# EAGLE design MainBoard 11-12 (EAGLE 5.11)
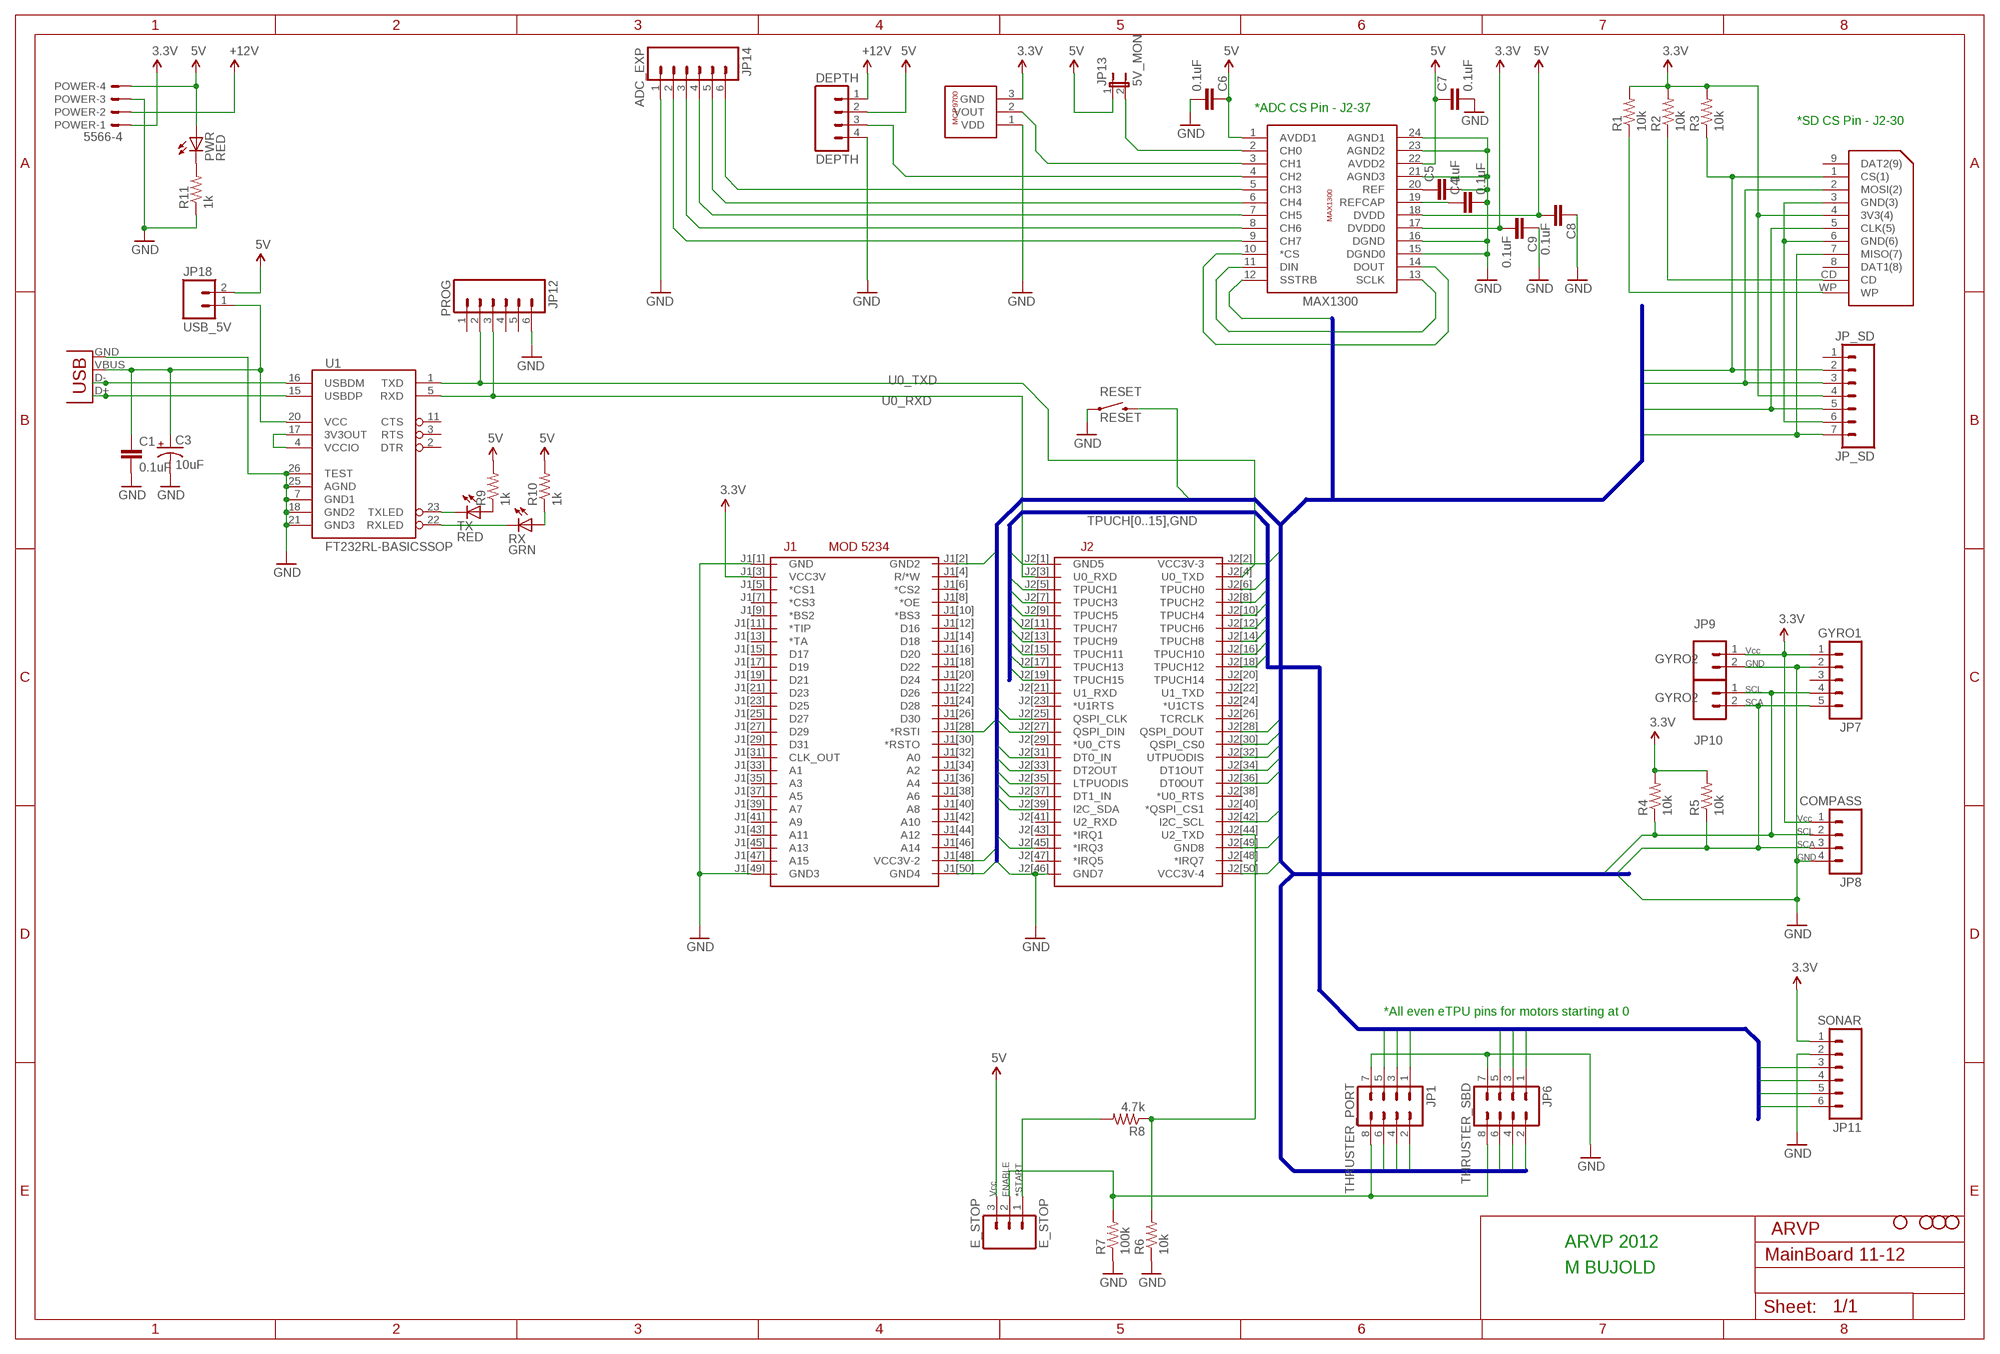
[diagram p0: schematic, sheet 1]

## Parts
C1  0.1uF  CAP1206  [1206]
C3  10uF  CAP_POL1206  [EIA3216]
C4  0.1uF  CAP1206  [1206]
C5  1uF  CAP1206  [1206]
C6  0.1uF  CAP1206  [1206]
C7  0.1uF  CAP1206  [1206]
C8  0.1uF  CAP1206  [1206]
C9  0.1uF  CAP1206  [1206]
DEPTH  DEPTH  M04POLAR  [MOLEX-1X4]
E_STOP  E_STOP  M03POLAR  [MOLEX-1X3]
JP1  THRUSTER_PORT  M04X2  [2X4]
JP2  STAND-OFF  [STAND-OFF]
JP3  STAND-OFF  [STAND-OFF]
JP4  STAND-OFF  [STAND-OFF]
JP5  STAND-OFF  [STAND-OFF]
JP6  THRUSTER_SBD  M04X2  [2X4]
JP7  GYRO1  M05LOCK  [1X05_LOCK]
JP8  COMPASS  M04POLAR_LOCK  [MOLEX-1X4_LOCK]
JP9  GYRO2  M02PTH  [1X02]
JP10  GYRO2  M02PTH  [1X02]
JP11  SONAR  M06LOCK  [1X06_LOCK]
JP12  PROG  M06LOCK  [1X06_LOCK]
JP13  5V_MON  JUMPER-2PTH_LOCK  [1X02_LOCK]
JP14  ADC_EXP  M06LOCK  [1X06_LOCK]
JP18  USB_5V  M02LOCK  [1X02_LOCK]
JP_SD  JP_SD  M07LOCK  [1X07_LOCK]
POWER  5566-4  [5566-4]
PWR  RED  LED3MM  [LED3MM]
R1  10k  RESISTOR1206  [1206]
R2  10k  RESISTOR1206  [1206]
R3  10k  RESISTOR1206  [1206]
R4  10k  RESISTOR1206  [1206]
R5  10k  RESISTOR1206  [1206]
R6  10k  RESISTOR1206  [1206]
R7  100k  RESISTOR1206  [1206]
R8  4.7k  RESISTOR1206  [1206]
R9  1k  RESISTOR1206  [1206]
R10  1k  RESISTOR1206  [1206]
R11  1k  RESISTOR1206  [1206]
RESET  SWITCH-MOMENTARY-2PTH  [TACTILE-PTH]
RX  GRN  LED3MM  [LED3MM]
TX  RED  LED3MM  [LED3MM]
U1  FT232RL-BASICSSOP  [SSOP28DB]
U$1  MOD5234  [MOD5234]
U$2  SD_CARD  [SD_CARD]
U$5  MAX1300  [MAX1300]
U$6  MCP9700  [TO-92]
U$7  ARVP_LOGO  [ARVP]
X2  USB-SMD-NS  [USB-MINIB-NOSTOP]

## Nets
3.3V: C9.2 JP7.1 JP8.1 JP9.1 JP11.1 JP_SD.4 POWER.1 R1.2 R2.2 R3.2 R4.2 R5.2 U$1.J1[3](VCC3V) U$2.4(3V3(4)) U$5.17(DVDD0) U$6.3(GND)
5V: C6.1 C7.1 C8.2 DEPTH.2 E_STOP.3 JP13.1 JP18.2 POWER.4 PWR.A R9.2 R10.2 U$5.1(AVDD1) U$5.18(DVDD) U$5.22(AVDD2)
12V: DEPTH.1 POWER.2 ; supply symbol labelled +12V
*IRQ3: U$1.J2[45](*IRQ3) U$5.12(SSTRB)
*RSTI: RESET.3 U$1.J1[28](*RSTI)
CS_ADC: U$1.J2[37](DT1_IN) U$5.10(*CS)
CS_SD: JP_SD.2 R3.1 U$1.J2[30](QSPI_CS0) U$2.1(CS(1))
DIR0: JP6.2 U$1.J2[31](DT0_IN)
DIR1: JP1.6 U$1.J2[32](UTPUODIS)
DIR2: JP6.4 U$1.J2[33](DT2OUT)
DIR3: JP1.4 U$1.J2[34](DT1OUT)
DIR4: JP6.6 U$1.J2[35](LTPUODIS)
DIR5: JP1.2 U$1.J2[36](DT0OUT)
GND: C1.2 C3.C(-) C4.2 C5.2 C6.2 C7.2 C8.1 C9.1 DEPTH.4 JP1.7 JP6.7 JP7.2 JP8.4 JP9.2 JP11.2 JP12.6 JP14.1 POWER.3 R6.1 R7.1 R11.1 RESET.1 U1.7(GND1) U1.18(GND2) U1.21(GND3) U1.25(AGND) U1.26(TEST) U$1.J1[1](GND) U$1.J1[2](GND2) U$1.J1[49](GND3) U$1.J1[50](GND4) U$1.J2[1](GND5) U$1.J2[46](GND7) U$1.J2[49](GND8) U$5.15(DGND0) U$5.16(DGND) U$5.21(AGND3) U$5.23(AGND2) U$5.24(AGND1) U$6.1(VDD) X2.GND
I2C_SCL: JP7.4 JP8.2 JP10.1 R4.1 U$1.J2[42](I2C_SCL)
I2C_SDA: JP7.5 JP8.3 JP10.2 R5.1 U$1.J2[39](I2C_SDA)
N$1: C1.1 C3.A(+) JP18.1 U1.20(VCC) X2.VBUS
N$2: R6.2 R8.1 U$1.J2[44](U2_TXD)
N$3: C4.1 U$5.19(REFCAP)
N$4: PWR.K(C) R11.2
N$5: U$5.3(CH1) U$6.2(VOUT)
N$6: U1.15(USBDP) X2.D+
N$7: JP14.3 U$5.8(CH6)
N$8: TX.K(C) U1.23(TXLED)
N$9: RX.K(C) U1.22(RXLED)
N$10: JP13.2 U$5.2(CH0)
N$11: E_STOP.2 JP1.8 JP6.8 R7.2
N$12: R9.1 TX.A
N$13: JP14.4 U$5.7(CH5)
N$14: JP14.5 U$5.6(CH4)
N$15: DEPTH.3 U$5.4(CH2)
N$16: JP14.6 U$5.5(CH3)
N$17: C5.1 U$5.20(REF)
N$18: R10.1 RX.A
N$19: U1.4(VCCIO) U1.17(3V3OUT)
N$20: JP14.2 U$5.9(CH7)
N$21: JP_SD.6 U$2.3(GND(3)) U$2.6(GND(6))
N$22: R2.1 U$2.CD
N$24: R1.1 U$2.WP
N$43: E_STOP.1 R8.2
PROG: U1.16(USBDM) X2.D-
QSPI_CLK: JP_SD.5 U$1.J2[25](QSPI_CLK) U$2.5(CLK(5)) U$5.13(SCLK)
QSPI_DIN: U$1.J2[27](QSPI_DIN) U$5.14(DOUT)
QSPI_DOUT: JP_SD.3 JP_SD.7 U$1.J2[28](QSPI_DOUT) U$2.2(MOSI(2)) U$2.7(MISO(7)) U$5.11(DIN)
TPUCH0: JP6.1 U$1.J2[6](TPUCH0)
TPUCH1: JP11.3 U$1.J2[5](TPUCH1)
TPUCH2: JP6.3 U$1.J2[8](TPUCH2)
TPUCH3: JP11.4 U$1.J2[7](TPUCH3)
TPUCH4: JP6.5 U$1.J2[10](TPUCH4)
TPUCH5: JP11.5 U$1.J2[9](TPUCH5)
TPUCH6: JP1.1 U$1.J2[12](TPUCH6)
TPUCH7: JP11.6 U$1.J2[11](TPUCH7)
TPUCH8: JP1.3 U$1.J2[14](TPUCH8)
TPUCH9: U$1.J2[13](TPUCH9)
TPUCH10: JP1.5 U$1.J2[16](TPUCH10)
TPUCH11: U$1.J2[15](TPUCH11)
TPUCH12: U$1.J2[18](TPUCH12)
TPUCH13: U$1.J2[17](TPUCH13)
TPUCH15: U$1.J2[19](TPUCH15)
U0_RXD: JP12.3 U1.5(RXD) U$1.J2[3](U0_RXD)
U0_TXD: JP12.2 U1.1(TXD) U$1.J2[4](U0_TXD)
VCC3V: U$1.J1[48](VCC3V-2) U$1.J2[2](VCC3V-3) U$1.J2[50](VCC3V-4)
Unconnected: JP7.3 JP12.1 JP12.4 JP12.5 JP_SD.1 U1.2(DTR) U1.3(RTS) U1.11(CTS) U$1.J1[4](R/*W) U$1.J1[5](*CS1) U$1.J1[6](*CS2) U$1.J1[7](*CS3) U$1.J1[8](*OE) U$1.J1[9](*BS2) U$1.J1[10](*BS3) U$1.J1[11](*TIP) U$1.J1[12](D16) U$1.J1[13](*TA) U$1.J1[14](D18) U$1.J1[15](D17) U$1.J1[16](D20) U$1.J1[17](D19) U$1.J1[18](D22) U$1.J1[19](D21) U$1.J1[20](D24) U$1.J1[21](D23) U$1.J1[22](D26) U$1.J1[23](D25) U$1.J1[24](D28) U$1.J1[25](D27) U$1.J1[26](D30) U$1.J1[27](D29) U$1.J1[29](D31) U$1.J1[30](*RSTO) U$1.J1[31](CLK_OUT) U$1.J1[32](A0) U$1.J1[33](A1) U$1.J1[34](A2) U$1.J1[35](A3) U$1.J1[36](A4) U$1.J1[37](A5) U$1.J1[38](A6) U$1.J1[39](A7) U$1.J1[40](A8) U$1.J1[41](A9) U$1.J1[42](A10) U$1.J1[43](A11) U$1.J1[44](A12) U$1.J1[45](A13) U$1.J1[46](A14) U$1.J1[47](A15) U$1.J2[20](TPUCH14) U$1.J2[21](U1_RXD) U$1.J2[22](U1_TXD) U$1.J2[23](*U1RTS) U$1.J2[24](*U1CTS) U$1.J2[26](TCRCLK) U$1.J2[29](*U0_CTS) U$1.J2[38](*U0_RTS) U$1.J2[40](*QSPI_CS1) U$1.J2[41](U2_RXD) U$1.J2[43](*IRQ1) U$1.J2[47](*IRQ5) U$1.J2[48](*IRQ7) U$2.8(DAT1(8)) U$2.9(DAT2(9))

## Buses
VCC3V,QSPI_CLK,QSPI_DIN,QSPI_DOUT,I2C_SDA,I2C_SCL,*RSTI,GND,*IRQ3,CS_ADC,CS_SD,DIR0,DIR1,DIR2,DIR3,DIR4,DIR5
TPUCH[0..15],GND

## Notes on the sheet
- *ADC CS Pin - J2-37
- *SD CS Pin - J2-30
- RESET
- Vcc
- GND
- SCL
- SCA
- Vcc
- SCL
- SCA
- GND
- *All even eTPU pins for motors starting at 0
- Vcc | ENABLE | *START
- ARVP 2012
- M BUJOLD

## Library data of the parts
C1 C4-C9 = SparkFun:CAP: Capacitor Standard 0603 ceramic capacitor, and 0.1" leaded capacitor.
C3 = SparkFun:CAP_POL: Capacitor Polarized These are standard SMD and PTH capacitors. Normally 10uF, 47uF, and 100uF in electrolytic and tantalum varieties. Always verify the external diameter of the through hole cap, it varies with capacity, voltage, and manufacturer. The EIA devices should be standard.
DEPTH JP8 = SparkFun:M04: Header 4 Standard 4-pin 0.1" header. Use with straight break away headers (SKU : PRT-00116), right angle break away headers (PRT-00553), swiss pins (PRT-00743), machine pins (PRT-00117), and female headers (PRT-00115). Molex polarized connector foot print use with SKU : PRT-08231 with associated crimp pins and housings. 1MM SMD Version SKU: PRT-10208
E_STOP = SparkFun:M03: Header 3 Standard 3-pin 0.1" header. Use with straight break away headers (SKU : PRT-00116), right angle break away headers (PRT-00553), swiss pins (PRT-00743), machine pins (PRT-00117), and female headers (PRT-00115). Molex polarized connector foot print use with SKU : PRT-08232 with associated crimp pins and housings.
JP1 JP6 = SparkFun:M04X2
JP2-JP5 = SparkFun:STAND-OFF: Stand Off This is the mechanical footprint for a #4 phillips button head screw. Use the keepout ring to avoid running the screw head into surrounding components. SKU : PRT-00447
JP7 = SparkFun:M05: Header 5 Standard 5-pin 0.1" header. Use with straight break away headers (SKU : PRT-00116), right angle break away headers (PRT-00553), swiss pins (PRT-00743), machine pins (PRT-00117), and female headers (PRT-00115). Molex polarized connector foot print use with SKU : PRT-08230 with associated crimp pins and housings.
JP9 JP10 JP18 = SparkFun:M02: Header 2 Standard 2-pin 0.1" header. Use with straight break away headers (SKU : PRT-00116), right angle break away headers (PRT-00553), swiss pins (PRT-00743), machine pins (PRT-00117), and female headers (PRT-00115). Molex polarized connector foot print use with SKU : PRT-08233 with associated crimp pins and housings.
JP11 JP12 JP14 = SparkFun:M06: Header 6 Standard 6-pin 0.1" header. Use with straight break away headers (SKU : PRT-00116), right angle break away headers (PRT-00553), swiss pins (PRT-00743), machine pins (PRT-00117), and female headers (PRT-00115). Molex polarized connector foot print use with SKU : PRT-08094 with associated crimp pins and housings. NOTES ON THE VARIANTS LOCK and LOCK_LONGPADS... This footprint was designed to help hold the alignment of a through-hole component (i.e. 6-pin header) while soldering it into place. You may notice that each hole has been shifted either up or down by 0.005 of an inch from it's more standard position (which is a perfectly straight line). This slight alteration caused the pins (the squares in the middle) to touch the edges of the holes. Because they are alternating, it causes a "brace" to hold the component in place. 0.005 has proven to be the perfect amount of "off-center" position when using our standard breakaway headers. Although looks a little odd when you look at the bare footprint, once you have a header in there, the alteration is very hard to notice. Also, if you push a header all the way into place, it is covered up entirely on the bottom side. This idea of altering the position of holes to aid alignment will be further integrated into the Sparkfun Library for other footprints. It can help hold any component with 3 or more connection pins.
JP13 = SparkFun:JUMPER-2: Jumper Basic 0.1" spaced jumper. Use with breakaway headers.
JP_SD = SparkFun:M07: Header 7 Standard 7-pin 0.1" header. Use with straight break away headers (SKU : PRT-00116), right angle break away headers (PRT-00553), swiss pins (PRT-00743), machine pins (PRT-00117), and female headers (PRT-00115). NOTES ON THE VARIANTS LOCK and LOCK_LONGPADS... This footprint was designed to help hold the alignment of a through-hole component (i.e. 7-pin header) while soldering it into place. You may notice that each hole has been shifted either up or down by 0.005 of an inch from it's more standard position (which is usually a perfectly straight line). This slight alteration caused the pins (the squares in the middle) to touch the edges of the holes. Because they are alternating, it causes a "brace" to hold the header in place. 0.005 has proven to be the perfect amount of "off-center" position when using our standard breakaway headers. Although looks a little odd when you look at the bare footprint, once you have a header in there, the alteration is very hard to notice. Also, if you push a header all the way into place, it is covered up entirely on the bottom side. This idea of altering the position of holes to aid alignment will be further integrated into the Sparkfun Library for other footprints. It can help hold any component with 3 or more connection pins.
POWER = con-molex:5566-4: Mini FIT connector 4 pol Source: http://www.molex.com; OC_FARNELL: unknown; OC_NEWARK: unknown
PWR RX TX = SparkFun:LED: LEDs Standard schematic elements and footprints for 5mm, 3mm, 1206, and 0603 sized LEDs. 5mm - Spark Fun Electronics SKU : COM-00529 (and others)
R1-R11 = SparkFun:RESISTOR: Resistor Basic schematic elements and footprints for 0603, 1206, and PTH 1/10th watt (small) resistors.
RESET = SparkFun:SWITCH-MOMENTARY-2
U1 = SparkFun:FT232RL-BASIC: USB UART This is the simplified version of the FT232RL unit. Only what you need, nothing you don't. Spark Fun Electronics SKU : COM-00650
U$1 = ARVP:MOD5234: NetBurner MOD5234
U$2 = ARVP:SD_CARD
U$5 = ARVP:MAX1300
U$6 = ARVP:MCP9700
U$7 = ARVP:ARVP_LOGO
X2 = SparkFun:USB: USB Connectors USB-B-PTH is fully proven SKU : PRT-00139 USB-miniB is fully proven SKU : PRT-00587 USB-A-PCB is untested. USB-A-H is throughly reviewed, but untested. Spark Fun Electronics SKU : PRT-00437 USB-B-SMT is throughly reviewed, but untested. Needs silkscreen touching up. USB-A-S has not been used/tested USB-MB-H has not been used/tested

## Board
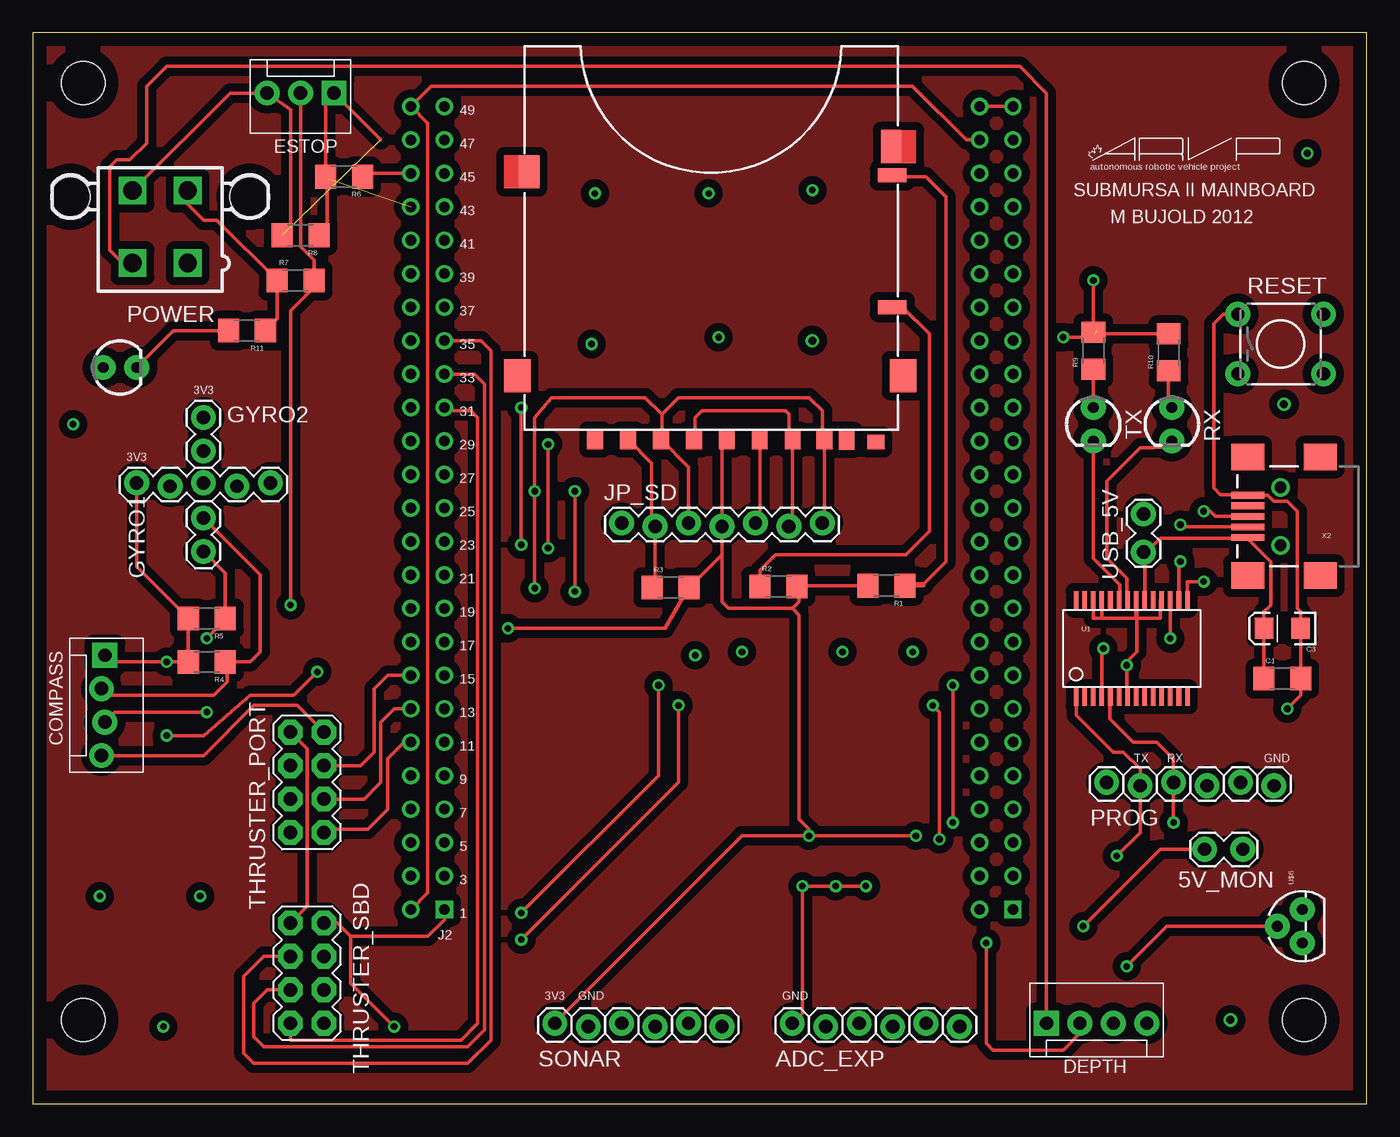
[diagram p1: board, top side]
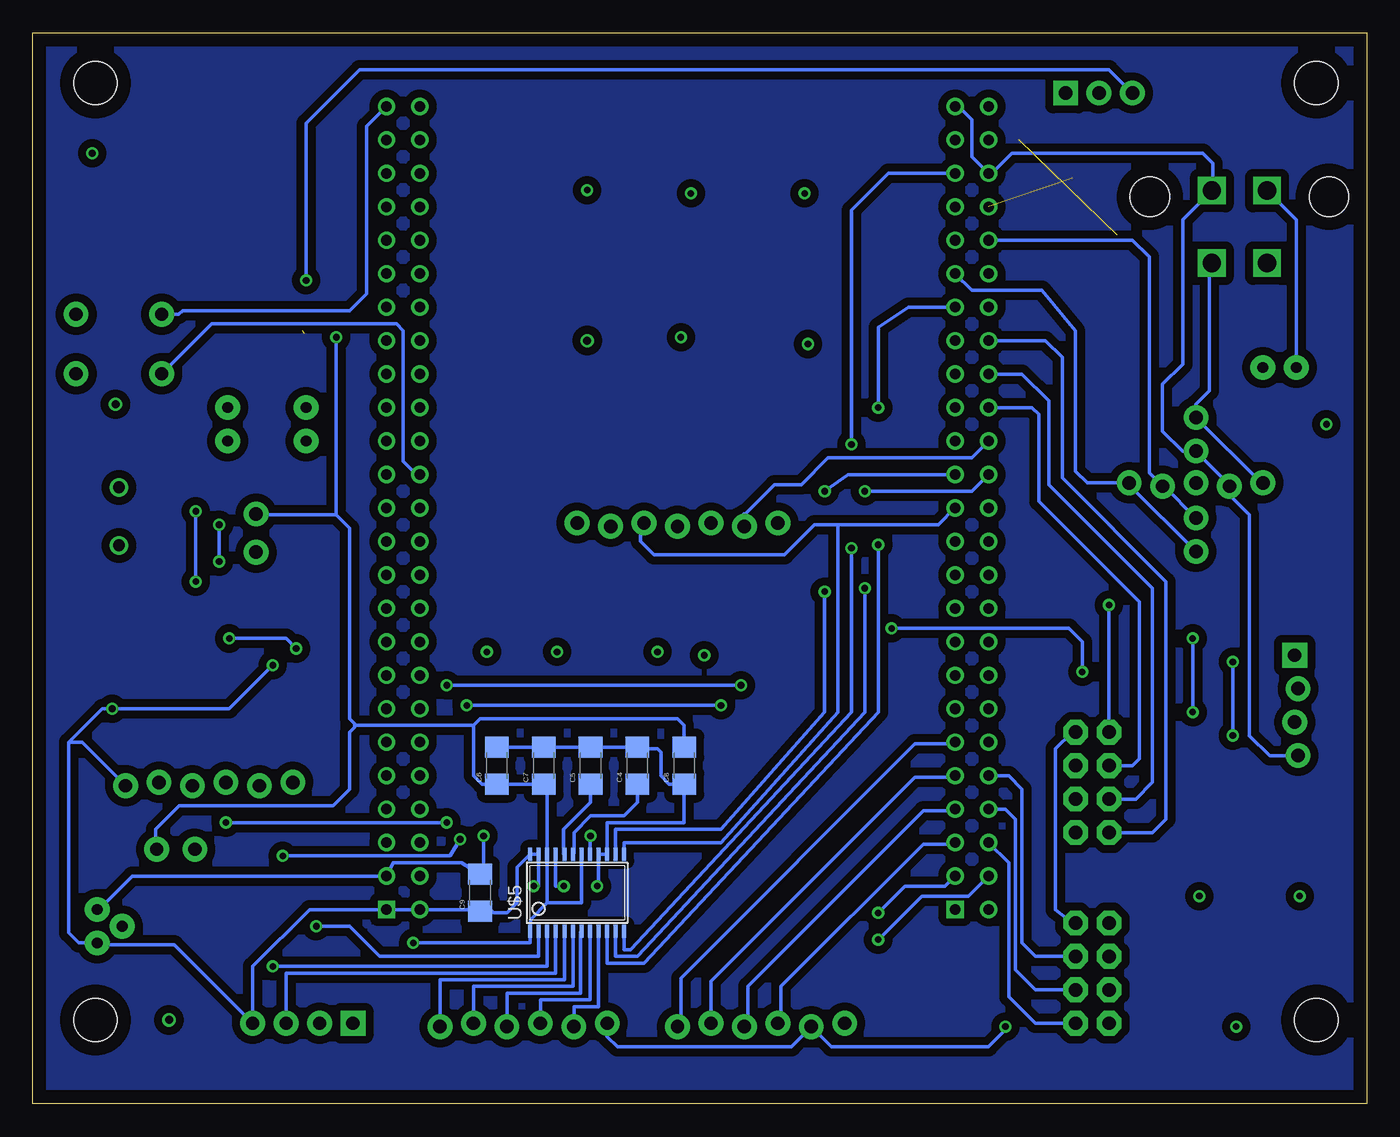
[diagram p2: board, bottom side, seen from below]

Size 101.27 x 81.27 mm. Coordinates in mm from the lower left corner, seen from the top.
Outline: 0,0 101.27,0 101.27,81.27 0,81.27 0,0
Copper layers (1*16): Top 0.035mm / dielectric 1.5mm / Bottom 0.035mm
Design rules "default *": minimum track width 10mil, minimum drill 20mil, track to track 8mil, track to pad 8mil, pad to pad 8mil, via to via 8mil, smd to smd 8mil, copper to edge 40mil, drill to drill 8mil, minimum pad ring 10mil, minimum via ring 8mil, stop-mask expansion 4mil, vias tented up to drill 0mil, thermal gap 10mil

### Footprints (pad centres in the part's own frame; a part is rotated, then mirrored left to right if it is on the bottom)
1206 = smd 1.6 x 1.8: 1 -1.4,0; 2 1.4,0
EIA3216 = smd 1.4 x 1.6: A 1.4,0; C -1.4,0
MOLEX-1X4 = drill 1.016 pad 1.88 square: 1 0,0 | drill 1.016 pad 1.88 round: 2 2.54,0; 3 5.08,0; 4 7.62,0
MOLEX-1X3 = drill 1.016 pad 1.88 square: 1 0,0 | drill 1.016 pad 1.88 round: 2 2.54,0; 3 5.08,0
2X4 = drill 1.016 pad 1.88 octagon: 1 -3.81,-1.27; 2 -3.81,1.27; 3 -1.27,-1.27; 4 -1.27,1.27; 5 1.27,-1.27; 6 1.27,1.27; 7 3.81,-1.27; 8 3.81,1.27
STAND-OFF = hole 3.302: 0,0
1X05_LOCK = drill 1.016 pad 1.88 round: 1 0,0.127; 2 2.54,-0.127; 3 5.08,0.127; 4 7.62,-0.127; 5 10.16,0.127
MOLEX-1X4_LOCK = drill 1.016 pad 1.88 square: 1 0,0.127 | drill 1.016 pad 1.88 round: 2 2.54,-0.127; 3 5.08,0.127; 4 7.62,-0.127
1X02 = drill 1.016 pad 1.88 round: 1 0,0; 2 2.54,0
1X06_LOCK = drill 1.016 pad 1.88 round: 1 0,0; 2 2.54,-0.254; 3 5.08,0; 4 7.62,-0.254; 5 10.16,0; 6 12.7,-0.254
1X02_LOCK = drill 1.016 pad 1.88 round: 1 -0.178,0; 2 2.718,0
1X07_LOCK = drill 1.016 pad 1.88 round: 1 0,0.127; 2 2.54,-0.127; 3 5.08,0.127; 4 7.62,-0.127; 5 10.16,0.127; 6 12.7,-0.127; 7 15.24,0.127
5566-4 = drill 1.4 square: 1 2.1,-2.75; 2 -2.1,-2.75; 3 2.1,2.75; 4 -2.1,2.75 | hole 3: 6.8,2.29; -6.8,2.29
LED3MM = drill 0.813 pad 1.88 round: A -1.27,0; K 1.27,0
TACTILE-PTH = drill 1.016 pad 1.88 round: 1 -3.251,2.261; 2 3.251,2.261; 3 -3.251,-2.261; 4 3.251,-2.261
SSOP28DB = smd 0.348 x 1.397: 1 -4.225,-3.656; 2 -3.575,-3.656; 3 -2.925,-3.656; 4 -2.275,-3.656; 5 -1.625,-3.656; 6 -0.975,-3.656; 7 -0.325,-3.656; 8 0.325,-3.656; 9 0.975,-3.656; 10 1.625,-3.656; 11 2.275,-3.656; 12 2.925,-3.656; 13 3.575,-3.656; 14 4.225,-3.656; 15 4.225,3.656; 16 3.575,3.656; 17 2.925,3.656; 18 2.275,3.656; 19 1.625,3.656; 20 0.975,3.656; 21 0.325,3.656; 22 -0.325,3.656; 23 -0.975,3.656; 24 -1.625,3.656; 25 -2.275,3.656; 26 -2.925,3.656; 27 -3.575,3.656; 28 -4.225,3.656
MOD5234 = drill 0.8 square: J1[1] -23.368,29.972; J2[1] 19.812,29.972 | drill 0.8 round: J1[2] -20.828,29.972; J1[3] -23.368,27.432; J1[4] -20.828,27.432; J1[5] -23.368,24.892; J1[6] -20.828,24.892; J1[7] -23.368,22.352; J1[8] -20.828,22.352; J1[9] -23.368,19.812; J1[10] -20.828,19.812; J1[11] -23.368,17.272; J1[12] -20.828,17.272; J1[13] -23.368,14.732; J1[14] -20.828,14.732; J1[15] -23.368,12.192; J1[16] -20.828,12.192; J1[17] -23.368,9.652; J1[18] -20.828,9.652; J1[19] -23.368,7.112; J1[20] -20.828,7.112; J1[21] -23.368,4.572; J1[22] -20.828,4.572; J1[23] -23.368,2.032; J1[24] -20.828,2.032; J1[25] -23.368,-0.508; J1[26] -20.828,-0.508; J1[27] -23.368,-3.048; J1[28] -20.828,-3.048; J1[29] -23.368,-5.588; J1[30] -20.828,-5.588; J1[31] -23.368,-8.128; J1[32] -20.828,-8.128; J1[33] -23.368,-10.668; J1[34] -20.828,-10.668; J1[35] -23.368,-13.208; J1[36] -20.828,-13.208; J1[37] -23.368,-15.748; J1[38] -20.828,-15.748; J1[39] -23.368,-18.288; J1[40] -20.828,-18.288; J1[41] -23.368,-20.828; J1[42] -20.828,-20.828; J1[43] -23.368,-23.368; J1[44] -20.828,-23.368; J1[45] -23.368,-25.908; J1[46] -20.828,-25.908; J1[47] -23.368,-28.448; J1[48] -20.828,-28.448; J1[49] -23.368,-30.988; J1[50] -20.828,-30.988; J2[2] 22.352,29.972; J2[3] 19.812,27.432; J2[4] 22.352,27.432; J2[5] 19.812,24.892; J2[6] 22.352,24.892; J2[7] 19.812,22.352; J2[8] 22.352,22.352; J2[9] 19.812,19.812; J2[10] 22.352,19.812; J2[11] 19.812,17.272; J2[12] 22.352,17.272; J2[13] 19.812,14.732; J2[14] 22.352,14.732; J2[15] 19.812,12.192; J2[16] 22.352,12.192; J2[17] 19.812,9.652; J2[18] 22.352,9.652; J2[19] 19.812,7.112; J2[20] 22.352,7.112; J2[21] 19.812,4.572; J2[22] 22.352,4.572; J2[23] 19.812,2.032; J2[24] 22.352,2.032; J2[25] 19.812,-0.508; J2[26] 22.352,-0.508; J2[27] 19.812,-3.048; J2[28] 22.352,-3.048; J2[29] 19.812,-5.588; J2[30] 22.352,-5.588; J2[31] 19.812,-8.128; J2[32] 22.352,-8.128; J2[33] 19.812,-10.668; J2[34] 22.352,-10.668; J2[35] 19.812,-13.208; J2[36] 22.352,-13.208; J2[37] 19.812,-15.748; J2[38] 22.352,-15.748; J2[39] 19.812,-18.288; J2[40] 22.352,-18.288; J2[41] 19.812,-20.828; J2[42] 22.352,-20.828; J2[43] 19.812,-23.368; J2[44] 22.352,-23.368; J2[45] 19.812,-25.908; J2[46] 22.352,-25.908; J2[47] 19.812,-28.448; J2[48] 22.352,-28.448; J2[49] 19.812,-30.988; J2[50] 22.352,-30.988
SD_CARD = smd 1.2 x 1.5: 1 6.88,12.07; 2 4.38,12.07; 3 1.88,12.07; 4 -0.62,12.07; 5 -3.12,12.07; 6 -5.62,12.07; 7 -8.04,12.07; 8 -9.728,12.09; 9 9.38,12.07 | smd 1.5 x 2.5: 12 -13.1,-10.18; 13 14.402,-8.255 | smd 2 x 2.5: 14 -14,7.22; 15 15.3,7.22 | smd 2.184 x 1.067: CD -13.18,2.02; WP -13.18,-7.98 | smd 1.3 x 1.1: SW -11.938,12.268
MAX1300 = smd 0.305 x 0.991: 1 -3.575,-2.918; 2 -2.925,-2.918; 3 -2.275,-2.918; 4 -1.625,-2.918; 5 -0.975,-2.918; 6 -0.325,-2.918; 7 0.325,-2.918; 8 0.975,-2.918; 9 1.625,-2.918; 10 2.275,-2.918; 11 2.925,-2.918; 12 3.575,-2.918; 13 3.575,2.918; 14 2.925,2.918; 15 2.275,2.918; 16 1.625,2.918; 17 0.975,2.918; 18 0.325,2.918; 19 -0.325,2.918; 20 -0.975,2.918; 21 -1.625,2.918; 22 -2.275,2.918; 23 -2.925,2.918; 24 -3.575,2.918
TO-92 = drill 0.813 pad 1.88 round: 1 -1.27,0; 2 0,1.905; 3 1.27,0
USB-MINIB-NOSTOP = smd 2.5 x 0.5: D+ 2.5,0; D- 2.5,0.8; GND 2.5,-1.6; ID 2.5,-0.8; VBUS 2.5,1.6 | smd 2.5 x 2: G1 -3,-4.5; G2 -3,4.5; G3 2.5,4.5; G4 2.5,-4.5 | drill 0.9 pad 0.8 round: H1 0,2.2 | drill 0.9 pad 0.787 round: H2 0,-2.2

### Placement (x,y rotation side)
C1  94.87,32.26 0 top
C3  94.87,36.07 180 top
C4  55.37,25.65 90 bottom
C5  58.93,25.65 90 bottom
C6  66.04,25.65 90 bottom
C7  62.48,25.65 90 bottom
C8  51.82,25.65 90 bottom
C9  67.31,16 90 bottom
DEPTH  76.96,6.1 0 top
E_STOP  22.86,76.71 180 top
JP1  20.83,24.38 90 top
JP2  96.52,77.47 0 top
JP3  3.81,77.47 0 top
JP4  3.81,6.35 0 top
JP5  96.52,6.35 0 top
JP6  20.83,9.91 90 top
JP7  7.87,46.99 0 top
JP8  5.33,34.04 270 top
JP9  12.95,52.07 270 top
JP10  12.95,44.45 270 top
JP11  39.62,6.1 0 top
JP12  81.53,24.38 0 top
JP13  91.69,19.3 180 top
JP14  57.66,6.1 0 top
JP18  84.33,42.04 90 top
JP_SD  44.7,43.94 0 top
POWER  9.65,66.55 0 top
PWR  6.6,55.88 0 top
R1  64.82,39.31 180 top
R2  56.61,39.25 0 top
R3  48.41,39.17 0 top
R4  13.21,33.53 180 top
R5  13.21,36.83 180 top
R6  23.62,70.36 180 top
R7  19.94,62.48 0 top
R8  20.32,65.91 180 top
R9  80.52,57.15 90 top
R10  86.23,57.02 90 top
R11  16.26,58.67 180 top
RESET  94.74,57.66 0 top
RX  86.49,51.56 270 top
TX  80.52,51.56 270 top
U1  83.44,34.54 0 top
U$1  51.05,44.7 180 top
U$2  52.07,62.48 180 top
U$5  59.94,16 0 bottom
U$6  96.39,13.46 90 top
U$7  80.26,70.87 0 top
X2  94.74,44.58 180 top

### Tracks (layer width: path | path; a pad name or v marks a point on that pad's centre or on a via)
3.3V  (via drill 0.51)
  Top 0.254: 52.32,50.05 JP_SD.4 52.32,41.68 | 58.07,39.31 R1.2 | JP8.1 5.97,33.53 v10.16,33.53 R4.2 R5.2 7.87,40.76 JP7.1 | 52.32,41.68 R3.2 49.78,39.14 48.01,36.07 v36.07,36.07 | v58.93,20.32 v67.06,20.32 | 52.32,41.68 52.32,38.1 52.83,37.59 57.66,37.59 | 57.66,37.59 58.17,38.1 58.17,39.09 R2.2 | 57.66,37.59 58.17,37.08 58.17,21.59 58.93,20.83 v58.93,20.32 | JP11.1 53.85,20.32 v58.93,20.32 | v21.59,32.77 19.81,30.99 16.51,30.99 12.95,27.94 v10.16,27.94
  Top 0.406: 52.32,50.05 U$2.4 | R2.2 58.07,39.31
  Bottom 0.254: JP7.1 8,47.12 JP9.1 12.95,53.09 11.94,54.1 11.94,63.61 POWER.1 | 58.93,18.88 U$5.17 58.97,20.32 v58.93,20.32 | U$6.3 96.27,14.73 93.73,17.27 U$1.J1[3] 73.91,18.29 68.7,18.29 C9.2 67.06,17.4 v67.06,20.32 | v36.07,36.07 22.61,36.07 21.59,35.05 v21.59,32.77 | v10.16,33.53 v10.16,27.94
5V  (via drill 0.51)  (1 unrouted)
  Top 0.254: R10.2 80.64,58.42 R9.2 v80.52,62.48 | 80.77,58.67 80.26,58.17 v78.23,58.17 | v72.39,12.19 72.39,4.57 72.9,4.06 78.23,4.06 79.5,5.33 DEPTH.2 | POWER.4 14.96,76.71 E_STOP.3 19.43,75.57 19.56,75.44 19.56,66.8 18.92,66.16
  Bottom 0.254: C8.2 51.82,28.7 52.32,29.21 67.31,29.21 67.82,28.7 | 67.82,28.7 67.82,24.89 67.18,24.25 C6.1 C7.1 62.22,23.99 U$5.22 | JP18.2 84.28,44.7 78.23,44.7 | 78.23,44.7 77.22,43.69 77.22,29.21 76.83,28.83 | 76.83,28.83 76.71,28.7 67.82,28.7 | 78.23,44.7 v78.23,58.17 | 62.22,15.25 63.5,13.97 63.5,13.1 U$5.1 63.52,12.19 v72.39,12.19 | 62.22,15.25 U$5.22 | U$5.22 62.22,19.81 | U$5.18 59.62,15.25 62.22,15.25 | JP13.1 91.95,19.38 91.95,20.83 90.17,22.61 78.49,22.61 77.22,23.88 77.22,28.19 76.83,28.57 76.83,28.83 | E_STOP.3 19.56,78.49 76.45,78.49 80.52,74.42 v80.52,62.48 | POWER.4 5.33,67.08 PWR.A
12V
  Top 0.254: DEPTH.1 76.96,76.71 74.93,78.74 10.16,78.74 8.64,77.22 8.64,72.9 7.37,71.63 6.35,71.63 5.84,71.12 5.84,64.77 6.81,63.8 POWER.2
*IRQ3  (via drill 0.51)
  Top 0.254: v39.12,42.16 v39.12,50.04
  Bottom 0.254: U$5.12 56.37,11.68 55.88,11.68 39.12,29.72 v39.12,42.16 | v39.12,50.04 39.12,67.82 36.32,70.61 U$1.J2[45]
*RSTI
  Bottom 0.254: RESET.3 87.71,59.18 73.66,59.18 73.15,58.67 73.15,48.77 72.14,47.75 U$1.J1[28]
CS_ADC  (via drill 0.51)
  Top 0.254: v37.08,42.42 v37.08,52.83
  Bottom 0.254: 57.66,10.67 57.66,13.07 U$5.10 57.67,10.67 54.86,10.67 37.08,29.72 v37.08,42.42 | v37.08,52.83 37.08,58.93 34.8,60.45 U$1.J2[37]
CS_SD
  Top 0.254: U$2.1 46.99,48.61 46.99,43.18 | JP_SD.2 47.24,39.4
  Top 0.406: 46.99,43.18 47.24,43.43 JP_SD.2 | 47.24,39.4 R3.1
  Bottom 0.254: U$1.J2[30] 29.97,49.02 40.89,49.02 42.93,46.99 44.96,46.99 47.24,44.7
  Bottom 0.406: 47.24,44.7 JP_SD.2
DIR0
  Top 0.254: U$1.J2[31] 31.5,52.58 33.27,52.58 33.78,52.07 33.78,6.1 32.51,4.83 19.56,4.83 JP6.2
DIR1
  Bottom 0.254: U$1.J2[32] 27.69,52.83 27.18,52.83 25.4,52.83 24.89,52.32 24.89,45.72 17.27,38.1 17.27,26.16 17.78,25.65 JP1.6
DIR2
  Top 0.254: U$1.J2[33] 33.53,55.37 34.29,54.61 34.29,5.59 33.02,4.32 17.53,4.32 16.76,5.08 16.76,7.62 17.78,8.64 JP6.4
DIR3
  Bottom 0.254: U$1.J2[34] 26.16,55.37 24.13,53.34 24.13,46.99 16.26,39.12 16.26,24.38 17.53,23.11 JP1.4
DIR4
  Top 0.254: U$1.J2[35] 34.04,57.91 34.8,57.15 34.8,4.83 33.02,3.05 16.76,3.05 16,3.81 16,9.65 17.53,11.18 JP6.6
DIR5
  Bottom 0.254: U$1.J2[36] 24.38,57.91 23.11,56.64 23.11,47.5 15.24,39.62 15.24,21.59 16.26,20.57 JP1.2
GND  (via drill 0.51)
  Top 0.254: U$1.J1[49] U$1.J1[50] | U1.7 83.06,30.94 v83.06,33.27 83.06,33.53 83.82,34.29 83.82,36.83 | U1.26 80.52,36.83 81.03,36.83 81.16,36.97 U1.25 81.16,36.83 83.82,36.83 | 83.82,36.83 83.82,38.2 U1.21 83.76,36.83 85.6,36.83 85.6,38.2 U1.18 | v95.25,29.97 96.27,30.99 C1.2 C3.C 96.27,37.34 96.01,37.59 96.01,44.96 95.25,45.72 94.23,45.72 93.78,46.18 X2.GND 92.19,46.23 90.17,46.23 89.66,46.74 89.66,59.18 90.4,59.92 RESET.1 | R6.1 25.28,70.61 U$1.J2[46] | v27.43,5.84 24.13,9.14 24.13,12.7 | 24.13,12.7 23.11,13.72 JP6.7 | 24.13,12.7 29.97,12.7 31.24,13.97 U$1.J2[1] | JP14.1 58.42,6.86 v58.42,16.51 v60.96,16.51 v63.25,16.51 | JP1.7 20.07,30.23 16.76,30.23 12.95,26.42 JP8.4 | POWER.3 11.75,68.26 12.95,67.06 13.97,67.06 R7.1 18.54,59.56 R11.1
  Bottom 0.254: U$1.J2[49] 30.99,75.69 29.97,74.68 29.97,71.88 U$1.J2[46] 28.45,70.61 26.92,72.14 12.45,72.14 11.68,71.37 11.68,69.34 11.71,69.34 POWER.3 13.97,67.08 13.97,56.13 15.49,54.61 15.49,51.05 13.97,49.53 JP9.2 10.41,46.99 JP7.2 10.41,46.23 8.89,44.7 8.89,27.94 7.37,26.42 JP8.4 | C6.2 C7.2 C5.2 C4.2 55.24,26.92 53.85,26.92 53.59,26.67 53.59,24.89 52.96,24.25 C8.1 51.82,21.34 57.67,21.34 U$5.15 U$5.16 58.32,16.61 v58.42,16.51 | v83.06,33.27 86.36,29.97 v95.25,29.97 96.01,29.97 98.55,27.43 | 98.55,27.43 98.55,12.95 97.79,12.19 U$6.1 96.01,12.19 95.89,12.06 90.55,12.06 DEPTH.4 84.58,10.41 80.26,14.73 U$1.J1[1] U$1.J1[2] 67.44,14.73 C9.1 66.42,14.6 66.29,14.48 65.28,14.48 64.52,15.24 64.52,17.92 U$5.24 U$5.23 62.87,16.51 v63.25,16.51 | JP12.6 97.54,27.43 98.55,27.43 | U$1.J1[49] 75.95,74.17 75.95,61.47 77.22,60.2 89.92,60.2 90.19,59.92 RESET.1 | JP1.7 22.35,28.19 23.62,26.92 23.62,14.73 22.35,13.72 JP6.7 | JP14.1 57.66,5.08 56.9,4.32 43.69,4.32 JP11.2 40.64,4.32 28.7,4.32 27.43,5.59 v27.43,5.84 | U$5.21 61.57,16.51 v60.96,16.51
I2C_SCL
  Top 0.254: JP8.2 5.71,30.99 13.72,30.99 14.73,32 14.73,33.02 14.61,33.14 R4.1 16.51,33.53 17.27,34.29 17.27,40.13 JP10.1
  Bottom 0.254: JP10.1 15.37,46.86 JP7.4 16.51,47.88 16.51,64.26 17.78,65.53 U$1.J2[42]
I2C_SDA  (via drill 0.51)
  Top 0.254: 15.24,36.58 14.99,36.83 R5.1 | JP10.2 14.61,40.26 R5.1 | JP8.3 6.22,29.72 v13.21,29.72 | v13.21,35.31 14.61,36.71 R5.1
  Bottom 0.254: JP10.2 18.03,46.99 JP7.5 21.21,47.12 22.1,48.01 22.1,58.67 24.64,61.72 29.97,61.72 U$1.J2[39] | v13.21,29.72 v13.21,35.31
N$1
  Top 0.254: C1.1 C3.A 93.47,37.34 93.98,37.85 93.98,41.15 92.24,42.89 X2.VBUS 92.19,42.93 85.6,42.93 84.58,41.91 84.41,41.91 84.41,41.66 | 84.41,41.66 U1.20 | JP18.1 84.33,41.66 84.41,41.66
N$2  (1 unrouted)
  Top 0.254: 22.22,76.07 R6.2 22.35,70.23 22.35,65.79 22.22,65.92 R8.1
N$3
  Bottom 0.254: C4.1 55.37,22.86 56.39,21.84 58.93,21.84 60.2,20.57 60.2,18.99 U$5.19
N$4
  Top 0.254: PWR.K 10.67,58.67 R11.2
N$5  (via drill 0.51)
  Top 0.254: v83.06,10.41 86.11,13.46 U$6.2
  Bottom 0.254: U$5.3 62.22,10.41 v83.06,10.41
N$6  (via drill 0.51)
  Top 0.254: U1.15 87.66,39.62 v88.9,39.62 | v88.9,44.96 89.41,44.96 89.79,44.58 X2.D+
  Bottom 0.254: v88.9,39.62 v88.9,44.96
N$7
  Bottom 0.254: U$5.8 58.97,7.87 62.74,7.87 JP14.3
N$8
  Top 0.254: U1.23 82.55,38.29 82.55,39.37 80.52,41.4 TX.K
N$9
  Top 0.254: U1.22 83.06,38.26 83.06,39.88 81.53,41.4 81.53,47.24 84.07,49.78 85.09,49.78 85.62,49.81 RX.K
N$10  (via drill 0.51)
  Top 0.254: v79.76,13.46 85.6,19.3 JP13.2
  Bottom 0.254: U$5.2 62.87,11.18 74.93,11.18 77.22,13.46 v79.76,13.46
N$11  (via drill 0.51)
  Top 0.254: JP6.8 20.83,14.99 20.83,26.92 JP1.8 | v19.56,37.85 19.56,60.2 21.34,61.98 R7.2 21.34,64 20.32,65.02 E_STOP.2
  Bottom 0.254: JP1.8 v19.56,37.85
N$12
  Top 0.254: TX.A R9.1
N$13
  Bottom 0.254: U$5.7 59.69,13.01 59.69,8.38 65.28,8.38 JP14.4
N$14
  Bottom 0.254: U$5.6 60.27,8.89 67.82,8.89 JP14.5
N$15
  Bottom 0.254: U$5.4 61.57,9.91 82.04,9.91 DEPTH.3
N$16
  Bottom 0.254: U$5.5 60.92,9.4 70.36,9.4 JP14.6
N$17
  Bottom 0.254: U$5.20 60.96,18.96 60.96,20.83 58.93,22.86 C5.1 59.06,24.25
N$18
  Top 0.254: 86.36,55.62 R10.1 86.23,53.09 RX.A
N$19  (via drill 0.51)
  Top 0.254: U1.4 81.16,34.54 v81.28,34.54 | v86.36,35.31 U1.17
  Bottom 0.254: v81.28,34.54 82.04,35.31 v86.36,35.31
N$20
  Bottom 0.254: U$5.9 58.32,7.37 60.2,7.37 JP14.2
N$21
  Top 0.254: 57.69,44.1 U$2.6 57.69,50.77 57.4,51.05 57.4,52.32 57.15,52.58 50.8,52.58 50.29,52.07 50.29,50.52 U$2.3
  Top 0.406: 57.69,44.1 JP_SD.6
N$22
  Top 0.254: 66.03,60.46 68.07,58.42 68.07,43.43 66.29,41.66 56.39,41.66 55.21,40.48 R2.1
  Top 0.406: R2.1 55.37,39.41 | 66.03,60.46 U$2.CD
N$23
  pour Bottom (isolate 0.61): 0.76,80.52 100.33,80.52 100.58,80.52 100.58,0.25 1.02,0.25 1.02,5.84 0.76,5.84
N$24
  Top 0.254: 65.36,70.36 67.82,70.36 69.34,68.83 69.34,41.15 67.56,39.37
  Top 0.406: 65.36,70.36 U$2.WP | R1.1 66.28,39.37 67.56,39.37
N$25
  pour Top (isolate 0.61): 0.76,80.52 100.58,80.52 100.58,1.27 1.78,1.27 1.78,0.76 0.76,0.76
N$26  (via drill 0.51)
  other vias: 42.67,69.09
N$27  (via drill 0.51)
  other vias: 51.31,69.09
N$28  (via drill 0.51)
  other vias: 59.18,69.34
N$29  (via drill 0.51)
  other vias: 96.77,72.14
N$30  (via drill 0.6)
  other vias: 95,53.09
N$31  (via drill 0.6)
  other vias: 90.93,6.35
N$32  (via drill 0.51)
  other vias: 9.91,5.84
N$33  (via drill 0.51)
  other vias: 5.08,15.75
N$34  (via drill 0.51)
  other vias: 12.7,15.75
N$35  (via drill 0.51)
  other vias: 3.05,51.56
N$36  (via drill 0.51)
  other vias: 42.42,57.66
N$37  (via drill 0.51)
  other vias: 52.07,58.17
N$38  (via drill 0.6)
  other vias: 59.18,57.91
N$39  (via drill 0.51)
  other vias: 50.29,34.04
N$40  (via drill 0.51)
  other vias: 53.85,34.29
N$41  (via drill 0.51)
  other vias: 61.47,34.29
N$42  (via drill 0.51)
  other vias: 66.8,34.29
N$43  (1 unrouted)
  Top 0.254: 26.42,73.15 E_STOP.1
PROG  (via drill 0.51)
  Top 0.254: U1.16 87.01,41.15 v87.12,41.15 | v87.12,43.94 87.29,43.78 X2.D-
  Bottom 0.254: v87.12,41.15 v87.12,43.94
QSPI_CLK
  Top 0.254: JP_SD.5 55.19,44.4 U$2.5
  Bottom 0.254: U$1.J2[25] 32.51,43.94 40.13,43.94 | 40.13,43.94 41.91,43.94 44.2,41.66 54.1,41.66 55.12,42.67 55.12,43.81 JP_SD.5 | U$5.13 56.37,19.81 49.02,19.81 40.13,29.72 40.13,43.94
QSPI_DIN  (via drill 0.51)
  Top 0.254: v41.15,38.86 v41.15,46.48
  Bottom 0.254: U$5.14 57.02,20.83 49.02,20.83 41.15,29.72 v41.15,38.86 | U$1.J2[27] 39.37,47.75 v41.15,46.48
QSPI_DOUT  (via drill 0.51)
  Top 0.254: 60.11,44.23 U$2.7 60.11,50.89 59.94,51.05 59.94,52.58 58.93,53.59 49.02,53.59 47.75,52.32 | JP_SD.3 49.78,48.32 U$2.2 47.75,50.48 47.75,52.32 | 47.75,52.32 46.48,53.59 39.37,53.59 38.1,52.07 v38.1,46.48 v38.1,39.12
  Top 0.406: 60.11,44.23 JP_SD.7
  Bottom 0.254: U$5.11 57.02,11.18 55.37,11.18 38.1,29.72 v38.1,39.12 | U$1.J2[28] 29.97,46.48 v38.1,46.48
TPUCH0
  Bottom 0.254: JP6.1 25.15,6.1 27.18,8.13 27.18,18.29 U$1.J2[6]
TPUCH1
  Bottom 0.254: U$1.J2[5] 31.37,19.68 33.66,19.68 44.45,8.89 44.45,6.99 44.7,6.73 JP11.3
TPUCH2
  Bottom 0.254: JP6.3 25.15,8.64 26.67,10.16 26.67,21.59 27.43,22.35 U$1.J2[8]
TPUCH3
  Bottom 0.254: U$1.J2[7] 31.37,22.23 33.66,22.23 46.99,8.89 46.99,5.08 47.24,5.33 JP11.4
TPUCH4
  Bottom 0.254: JP6.5 25.15,11.18 26.16,12.19 26.16,23.88 27.18,24.89 U$1.J2[10]
TPUCH5
  Bottom 0.254: U$1.J2[9] 31.37,24.77 34.29,24.77 49.78,9.27 JP11.5
TPUCH6
  Top 0.254: JP1.1 22.35,20.83 25.4,20.83 26.92,22.35 26.92,26.16 28.19,27.43 U$1.J2[12]
TPUCH7
  Bottom 0.254: U$1.J2[11] 31.37,27.3 34.29,27.3 52.07,9.53 52.07,6.35 52.32,6.1 JP11.6
TPUCH8
  Top 0.254: JP1.3 25.15,23.11 26.42,24.38 26.42,28.96 27.43,29.97 U$1.J2[14]
TPUCH10
  Top 0.254: JP1.5 24.89,25.65 25.91,26.67 25.91,31.5 26.92,32.51 U$1.J2[16]
U0_RXD  (via drill 0.51)
  Top 0.254: U1.5 81.79,30.89 81.79,29.21 83.57,27.43 85.34,27.43 86.61,26.16 JP12.3 v86.61,21.34 | v37.08,14.48 47.5,24.89 v47.5,31.75 | v69.85,31.75 v69.85,21.34
  Bottom 0.254: U$1.J2[3] 32,16.51 35.05,16.51 v37.08,14.48 | v47.5,31.75 v69.85,31.75 | v69.85,21.34 v86.61,21.34
U0_TXD  (via drill 0.51)
  Top 0.254: U1.1 79.25,30.85 79.25,29.46 82.04,26.67 82.8,26.67 84.07,25.4 JP12.2 84.07,20.57 v82.3,18.8 | v37.08,12.45 49.02,24.38 v49.02,30.23 | v68.33,30.23 68.83,29.72 v68.83,20.07
  Bottom 0.254: U$1.J2[4] 30.23,15.75 33.78,15.75 v37.08,12.45 | v49.02,30.23 v68.33,30.23 | v68.83,20.07 69.6,18.8 v82.3,18.8
VCC3V
  Top 0.254: U$1.J1[48] 70.87,73.15 66.8,77.22 30.23,77.22 U$1.J2[50] 29.97,74.42 29.97,16 U$1.J2[2]

### Text on the board
tPlace: ESTOP | SUBMURSA II MAINBOARD | M BUJOLD 2012 | 3V3 | 3V3 | COMPASS | TX | RX | GND | 3V3 | GND | GND | DEPTH